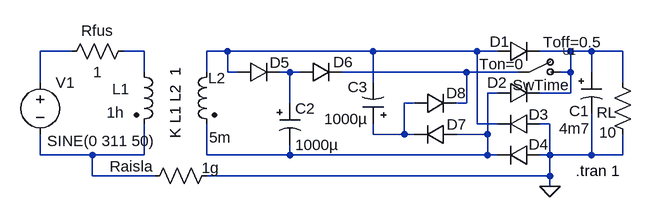
[diagram p0: schematic BoostRect.asc]
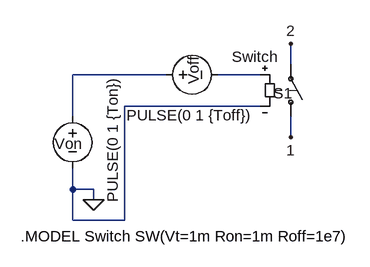
[diagram p1: sub-circuit swtime.asc]
BoostRect.asc, the LTspice schematic file:
Version 4
SHEET 1 880 680
WIRE -272 112 -320 112
WIRE -160 112 -192 112
WIRE -32 112 -64 112
WIRE 192 112 -32 112
WIRE 352 112 192 112
WIRE 384 112 352 112
WIRE 496 112 448 112
WIRE 528 112 496 112
WIRE 576 112 528 112
WIRE -160 144 -160 112
WIRE -64 144 -64 112
WIRE -32 144 -32 112
WIRE -16 144 -32 144
WIRE 64 144 48 144
WIRE 80 144 64 144
WIRE 336 144 144 144
WIRE 416 144 336 144
WIRE 496 144 496 112
WIRE 496 144 480 144
WIRE 528 144 528 112
WIRE -320 160 -320 112
WIRE 192 160 192 112
WIRE 576 160 576 112
WIRE 384 176 368 176
WIRE 496 176 496 144
WIRE 496 176 448 176
WIRE 64 192 64 144
WIRE 256 192 240 192
WIRE 336 192 336 144
WIRE 336 192 320 192
WIRE 352 224 352 112
WIRE 384 224 352 224
WIRE 464 224 448 224
WIRE 192 240 192 224
WIRE 240 240 240 192
WIRE 240 240 192 240
WIRE 256 240 240 240
WIRE 368 240 368 176
WIRE 368 240 320 240
WIRE -320 272 -320 240
WIRE -240 272 -320 272
WIRE -160 272 -160 224
WIRE -160 272 -240 272
WIRE -64 272 -64 224
WIRE 64 272 64 256
WIRE 64 272 -64 272
WIRE 368 272 368 240
WIRE 368 272 64 272
WIRE 384 272 368 272
WIRE 464 272 464 224
WIRE 464 272 448 272
WIRE 528 272 528 208
WIRE 528 272 464 272
WIRE 576 272 576 240
WIRE 576 272 528 272
WIRE -240 304 -240 272
WIRE -144 304 -240 304
WIRE 464 304 464 272
WIRE 464 304 -64 304
WIRE 464 320 464 304
FLAG 464 320 0
SYMBOL res -176 96 R90
WINDOW 0 0 56 VBottom 0
WINDOW 3 32 56 VTop 0
SYMATTR InstName Rfus
SYMATTR Value 1
SYMATTR SpiceLine tol=1 pwr=0.1
SYMBOL voltage -320 144 R0
WINDOW 3 11 106 Left 0
WINDOW 123 0 0 Left 0
WINDOW 39 0 0 Left 0
SYMATTR Value SINE(0 311 50)
SYMATTR InstName V1
SYMBOL diode 384 128 R270
WINDOW 0 15 3 VTop 0
WINDOW 3 0 32 Invisible 0
SYMATTR InstName D1
SYMATTR Value MURS320
SYMBOL diode 448 240 M270
WINDOW 0 15 1 VTop 0
WINDOW 3 0 32 Invisible 0
SYMATTR InstName D3
SYMATTR Value MURS320
SYMBOL diode 448 288 M270
WINDOW 0 17 1 VTop 0
WINDOW 3 0 32 Invisible 0
SYMATTR InstName D4
SYMATTR Value MURS320
SYMBOL diode 384 192 R270
WINDOW 0 16 -1 VTop 0
WINDOW 3 0 32 Invisible 0
SYMATTR InstName D2
SYMATTR Value MURS320
SYMBOL polcap 512 144 R0
WINDOW 0 -18 60 Left 0
WINDOW 3 -34 87 Left 0
SYMATTR InstName C1
SYMATTR Value 4m7
SYMATTR Description Capacitor
SYMATTR Type cap
SYMATTR SpiceLine V=25 Irms=3 Rser=0.017 MTBF=2000 Lser=0 mfg="Panasonic" pn="ECA1EFQ472" type="Al electrolytic" ppPkg=1
SYMBOL res -160 320 R270
WINDOW 0 15 -20 VTop 0
WINDOW 3 44 102 VBottom 0
SYMATTR InstName Raisla
SYMATTR Value 1g
SYMATTR SpiceLine tol=1 pwr=0.1
SYMBOL res 560 144 R0
WINDOW 0 -24 62 Left 0
WINDOW 3 -20 93 Left 0
SYMATTR InstName RL
SYMATTR Value 10
SYMATTR SpiceLine tol=1 pwr=0.1
SYMBOL ind2 -176 128 R0
WINDOW 0 -33 42 Left 0
WINDOW 3 -42 78 Left 0
SYMATTR InstName L1
SYMATTR Value 1h
SYMATTR SpiceLine Rser=1
SYMBOL ind2 -48 128 M0
WINDOW 0 -13 25 Left 0
WINDOW 3 -22 117 Left 0
SYMATTR InstName L2
SYMATTR Value 5m
SYMATTR SpiceLine Rser=.01
SYMBOL diode -16 160 R270
WINDOW 0 15 64 VTop 0
WINDOW 3 0 32 Invisible 0
SYMATTR InstName D5
SYMATTR Value MURS320
SYMBOL diode 80 160 R270
WINDOW 0 16 66 VTop 0
WINDOW 3 0 32 Invisible 0
SYMATTR InstName D6
SYMATTR Value MURS320
SYMBOL polcap 48 192 R0
WINDOW 3 24 64 Left 0
SYMATTR Value 1000µ
SYMATTR InstName C2
SYMATTR Description Capacitor
SYMATTR Type cap
SYMATTR SpiceLine V=35 Irms=1.98 Rser=0.029 Lser=0 mfg="Nichicon" pn="UPL1V102MRH" type="Al electrolytic"
SYMBOL polcap 208 224 R180
WINDOW 0 24 57 Left 0
WINDOW 3 24 8 Left 0
SYMATTR InstName C3
SYMATTR Value 1000µ
SYMATTR Description Capacitor
SYMATTR Type cap
SYMATTR SpiceLine V=50 Irms=1.11 Rser=0.053 Lser=0 mfg="Nichicon" pn="UPR1H102MRH" type="Al electrolytic"
SYMBOL diode 320 256 M270
WINDOW 0 16 -1 VTop 0
WINDOW 3 0 32 Invisible 0
SYMATTR InstName D7
SYMATTR Value MURS320
SYMBOL diode 256 208 R270
WINDOW 0 16 64 VTop 0
WINDOW 3 0 32 Invisible 0
SYMATTR InstName D8
SYMATTR Value MURS320
SYMBOL Robertugo\\SwTime 448 144 R0
WINDOW 39 -58 -12 Center 0
WINDOW 40 51 -46 Center 0
SYMATTR SpiceLine Ton=0
SYMATTR SpiceLine2 Toff=0.5
SYMATTR InstName U1
TEXT 504 296 Left 0 !.tran 1
TEXT -112 136 VRight 0 !K L1 L2  1

swtime.asc, the sub-circuit schematic file:
Version 4
SHEET 1 880 1444
WIRE 224 1152 224 1120
WIRE 32 1168 -112 1168
WIRE 176 1168 112 1168
WIRE 176 1216 -32 1216
WIRE -112 1232 -112 1168
WIRE 224 1264 224 1232
WIRE -112 1344 -112 1312
WIRE -80 1344 -112 1344
WIRE -80 1360 -80 1344
WIRE -112 1392 -112 1344
WIRE -32 1392 -32 1216
WIRE -32 1392 -112 1392
FLAG 224 1264 1
FLAG 224 1120 2
FLAG -80 1360 0
SYMBOL voltage -112 1216 R0
WINDOW 3 62 -45 VRight 0
WINDOW 123 0 0 Left 0
WINDOW 39 78 67 Left 0
WINDOW 0 -28 58 Left 0
SYMATTR Value PULSE(0 1 {Ton})
SYMATTR InstName Von
SYMBOL sw 224 1248 M180
WINDOW 0 -27 52 Left 0
WINDOW 3 -91 108 Left 0
SYMATTR InstName S1
SYMATTR Value Switch
SYMBOL voltage 16 1168 M90
WINDOW 3 62 -45 VRight 0
WINDOW 123 0 0 Left 0
WINDOW 39 78 67 Left 0
WINDOW 0 -28 58 Left 0
SYMATTR Value PULSE(0 1 {Toff})
SYMATTR InstName Voff
TEXT -192 1416 Left 0 !.MODEL Switch SW(Vt=1m Ron=1m Roff=1e7)

The netlist it stands for:
* BoostRect.asc
Rfus N002 N001 1 tol=1 pwr=0.1
V1 N001 N009 SINE(0 311 50)
D1 N003 N004 MURS320
D3 0 N003 MURS320
D4 0 N007 MURS320
D2 N007 N004 MURS320
C1 N004 0 4m7 V=25 Irms=3 Rser=0.017 MTBF=2000 Lser=0 mfg="Panasonic" pn="ECA1EFQ472" type="Al electrolytic" ppPkg=1
Raisla N009 0 1g tol=1 pwr=0.1
RL N004 0 10 tol=1 pwr=0.1
L1 N002 N009 1h Rser=1
L2 N003 N007 5m Rser=.01
D5 N003 N005 MURS320
D6 N005 N006 MURS320
C2 N005 N007 1000µ V=35 Irms=1.98 Rser=0.029 Lser=0 mfg="Nichicon" pn="UPL1V102MRH" type="Al electrolytic"
C3 N008 N003 1000µ V=50 Irms=1.11 Rser=0.053 Lser=0 mfg="Nichicon" pn="UPR1H102MRH" type="Al electrolytic"
D7 N007 N008 MURS320
D8 N008 N006 MURS320
XU1 N006 N004 swtime params: SwTime Ton=0 Toff=0.5

* block symbol definitions
.subckt swtime 1 2
Von N001 0 PULSE(0 1 {Ton})
S1 1 2 N002 0 Switch
Voff N001 N002 PULSE(0 1 {Toff})
.MODEL Switch SW(Vt=1m Ron=1m Roff=1e7)
.ends swtime

.model D D
.lib standard.dio
.tran 1
K L1 L2  1
.backanno
.end